# EAGLE design Cassette Port Mobo (EAGLE 9.6.2)
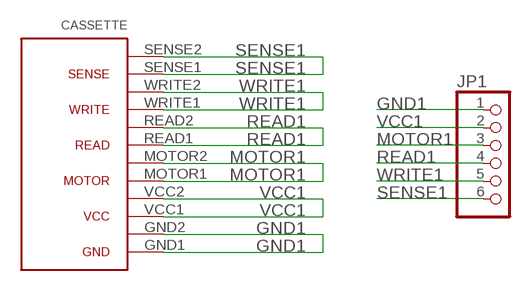
[diagram p0: schematic, sheet 1]

## Parts
CASSETTE  C64_CASSETTE  [C64_CASSETTE]
JP1  PINHD-1X6  [1X06]

## Nets
GND1: CASSETTE.GND1 CASSETTE.GND2 JP1.1
MOTOR1: CASSETTE.MOTOR1 CASSETTE.MOTOR2 JP1.3
READ1: CASSETTE.READ1 CASSETTE.READ2 JP1.4
SENSE1: CASSETTE.SENSE1 CASSETTE.SENSE2 JP1.6
VCC1: CASSETTE.VCC1 CASSETTE.VCC2 JP1.2
WRITE1: CASSETTE.WRITE1 CASSETTE.WRITE2 JP1.5

## Library data of the parts
CASSETTE = 0myparts:C64_CASSETTE
JP1 = pinhead:PINHD-1X6: PIN HEADER

## Board
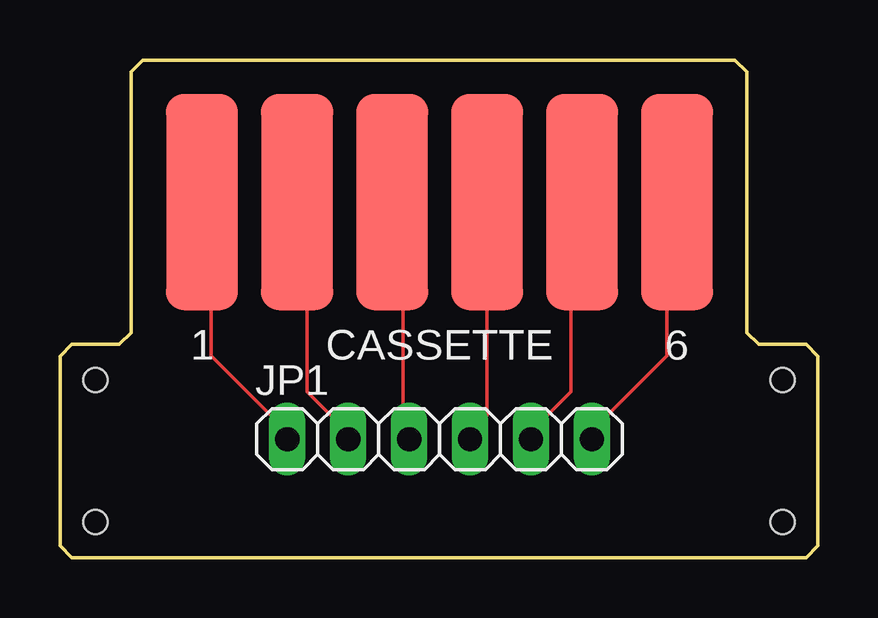
[diagram p1: board, top side]
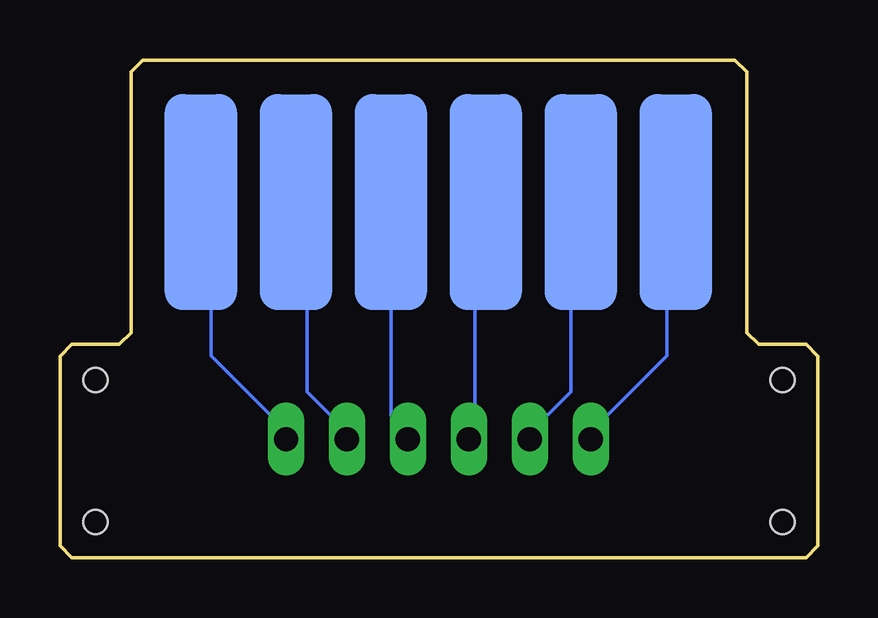
[diagram p2: board, bottom side, seen from below]

Size 31.6 x 20.74 mm. Coordinates in mm from the lower left corner, seen from the top.
Outline: 3.46,20.74 2.96,20.24 2.96,9.38 2.47,8.89 0.49,8.89 0,8.39 0,0.49 0.49,0 31.11,0 31.6,0.49 31.6,8.39 31.11,8.89 29.13,8.89 28.64,9.38 28.64,20.24 28.14,20.74 3.46,20.74
Copper layers (1*16): Top 0.035mm / dielectric 1.5mm / Bottom 0.035mm
Design rules "default": minimum track width 6mil, minimum drill 0.35mm, track to track 6mil, track to pad 6mil, pad to pad 6mil, via to via 6mil, smd to smd 6mil, copper to edge 40mil, drill to drill 6mil, minimum pad ring 10mil, minimum via ring 8mil, stop-mask expansion 4mil, vias tented up to drill 0mil, thermal gap 10mil
Holes 1 mm at 1.48,1.48 1.48,7.41 30.12,7.41 30.12,1.48

### Footprints (pad centres in the part's own frame; a part is rotated, then mirrored left to right if it is on the bottom)
C64_CASSETTE = smd 3 x 9: GND1 0,0; MOTOR1 7.92,0; READ1 11.88,0; SENSE1 19.8,0; VCC1 3.96,0; WRITE1 15.84,0 | smd 3 x 9 bottom: GND2 0,0; MOTOR2 7.92,0; READ2 11.88,0; SENSE2 19.8,0; VCC2 3.96,0; WRITE2 15.84,0
1X06 = drill 1.016 long: 1 -6.35,0; 2 -3.81,0; 3 -1.27,0; 4 1.27,0; 5 3.81,0; 6 6.35,0

### Placement (x,y rotation side)
CASSETTE  5.93,14.81 0 top
JP1  15.83,4.94 0 top

### Tracks (layer width: path | path; a pad name or v marks a point on that pad's centre or on a via)
GND1
  Top 0.152: CASSETTE.GND2 6.3,14.41 6.3,8.41 9.3,5.41 JP1.1
  Bottom 0.152: JP1.1 9.3,5.41 6.3,8.41 6.3,14.41 CASSETTE.GND2
MOTOR1
  Top 0.152: JP1.3 14.3,5.41 14.3,14.41 CASSETTE.MOTOR2
  Bottom 0.152: CASSETTE.MOTOR2 14.3,14.41 14.3,5.41 JP1.3
READ1
  Top 0.152: CASSETTE.READ2 17.8,14.41 17.8,5.91 17.3,5.41 JP1.4
  Bottom 0.152: JP1.4 17.3,5.41 17.8,5.91 17.8,14.41 CASSETTE.READ2
SENSE1
  Top 0.152: CASSETTE.SENSE2 25.3,14.41 25.3,8.41 22.3,5.41 JP1.6
  Bottom 0.152: JP1.6 22.3,5.41 25.3,8.41 25.3,14.41 CASSETTE.SENSE2
VCC1
  Top 0.152: CASSETTE.VCC2 10.3,14.41 10.3,6.91 11.8,5.41 JP1.2
  Bottom 0.152: JP1.2 11.8,5.41 10.3,6.91 10.3,14.41 CASSETTE.VCC2
WRITE1
  Top 0.152: CASSETTE.WRITE2 21.3,14.41 21.3,6.91 19.8,5.41 JP1.5
  Bottom 0.152: JP1.5 19.8,5.41 21.3,6.91 21.3,14.41 CASSETTE.WRITE2